# Altium schematic sheet [03] - 28PINS SCHEMATIC.SchDoc (part 1 of 3)
size A2; DocumentNumber: 3; SheetNumber: 3; SheetTotal: 5
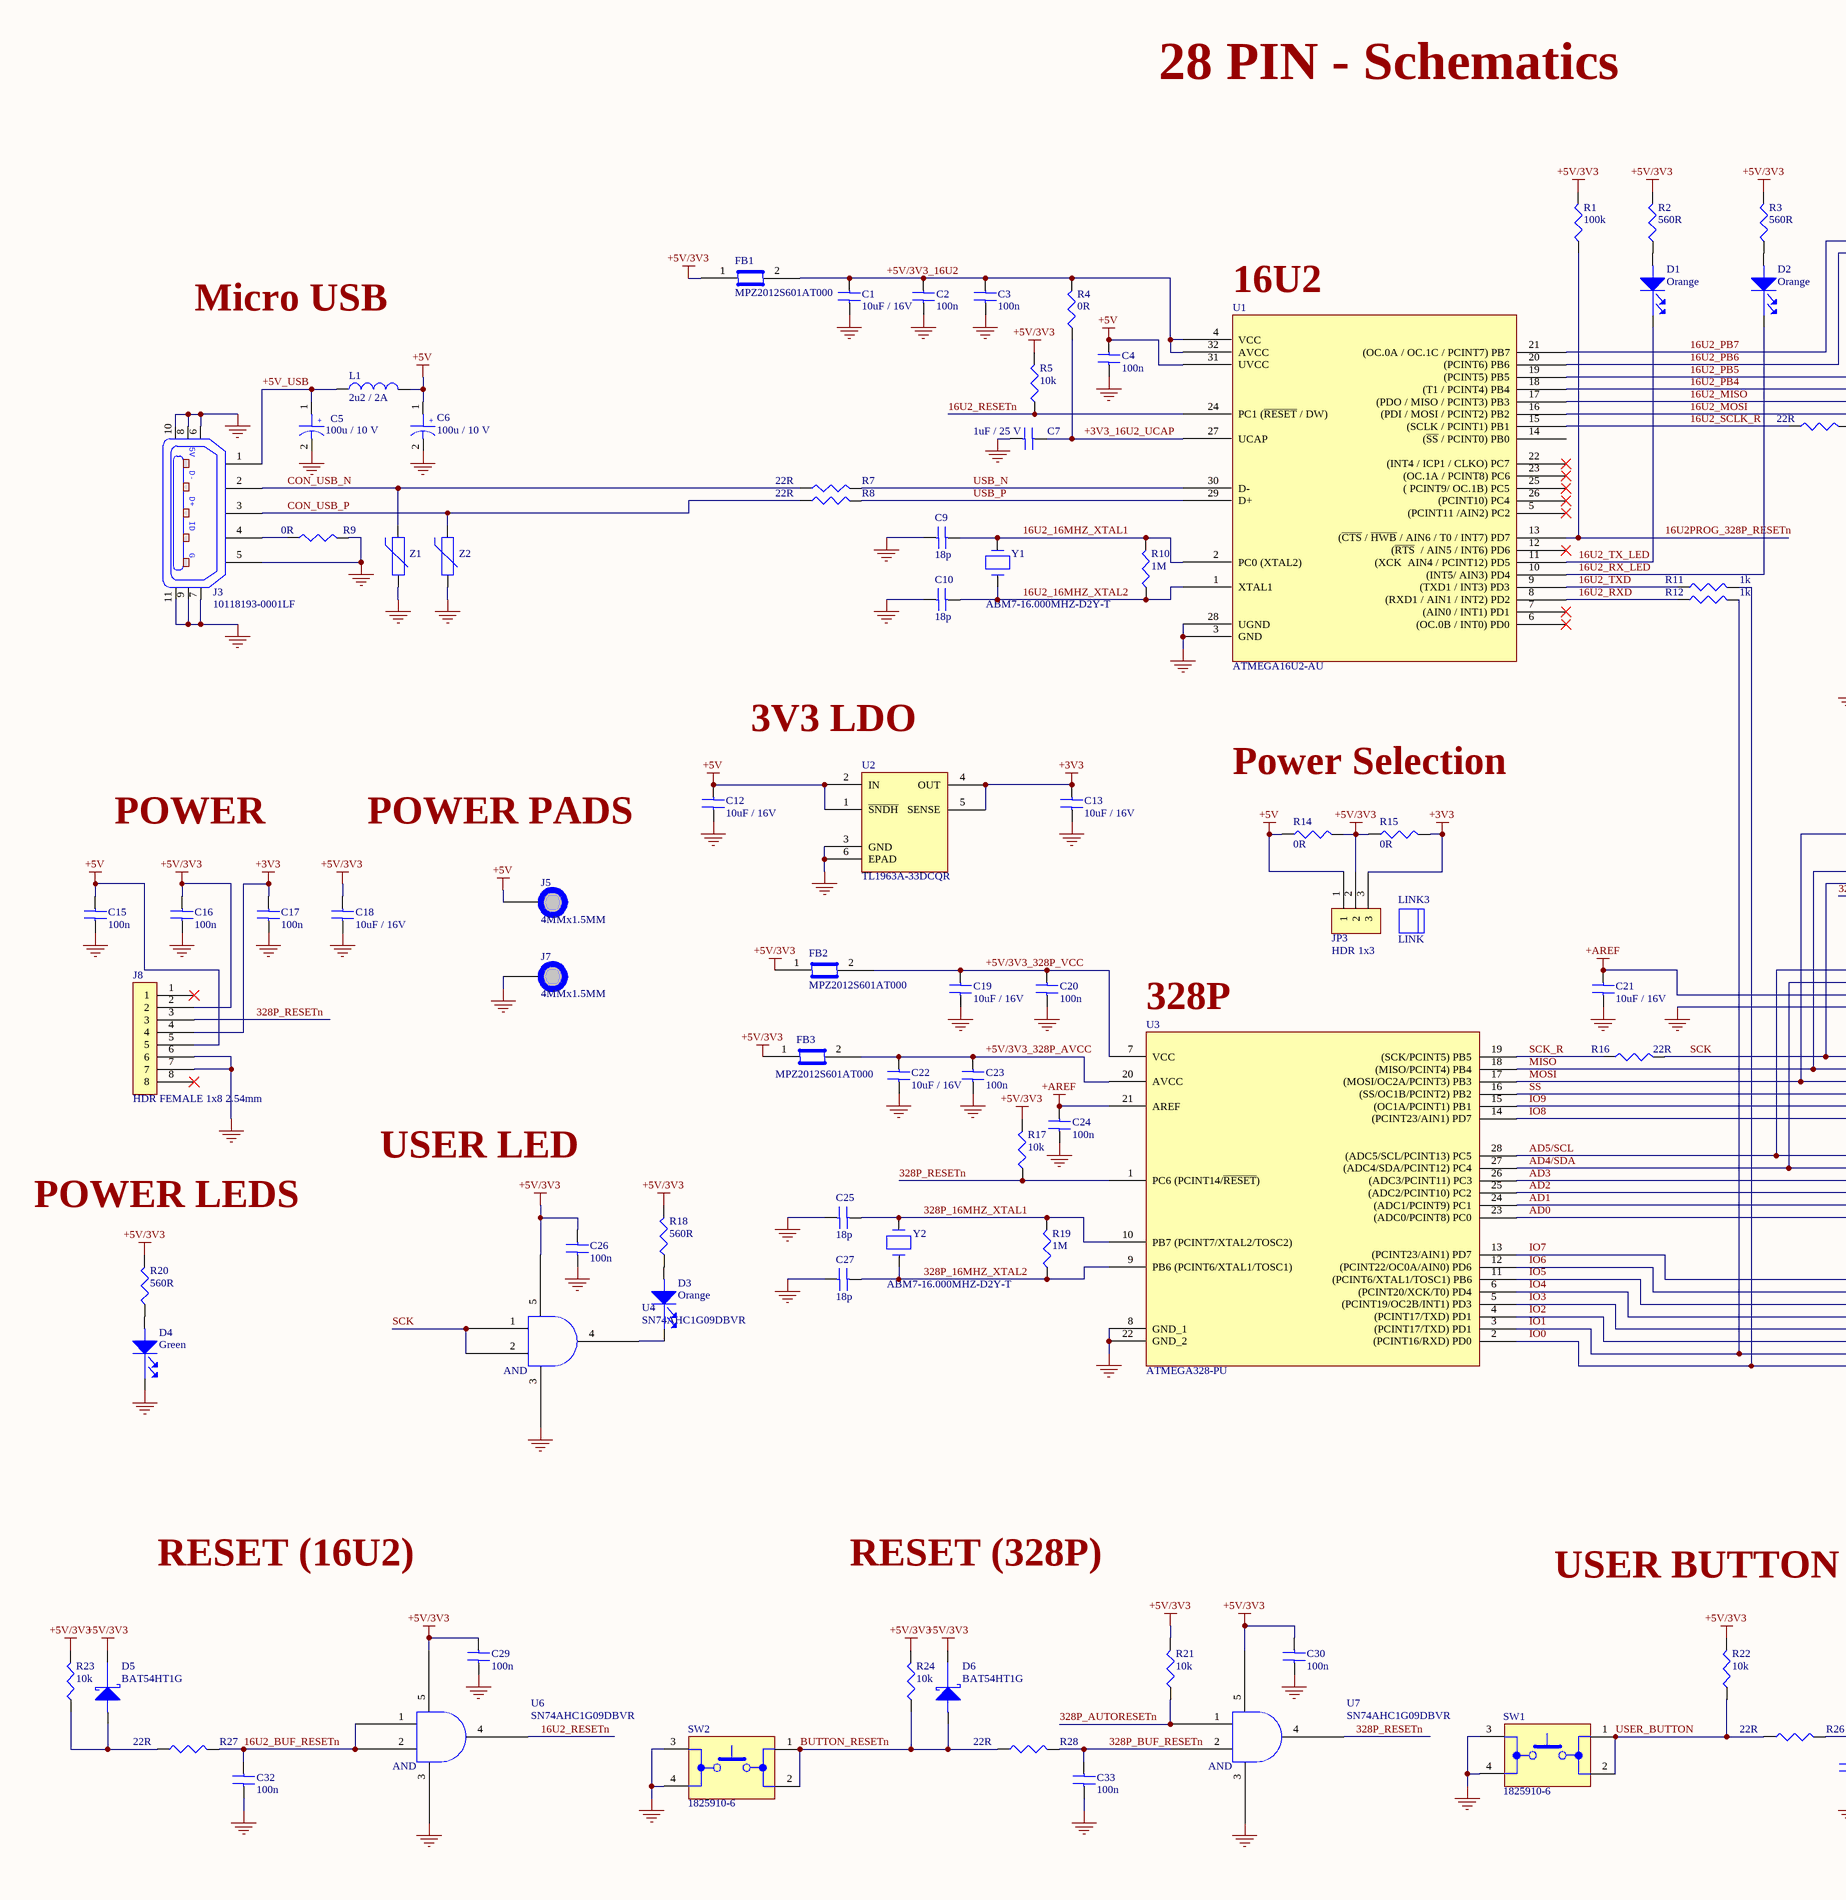
[diagram p0: [03] - 28PINS SCHEMATIC.SchDoc, left]
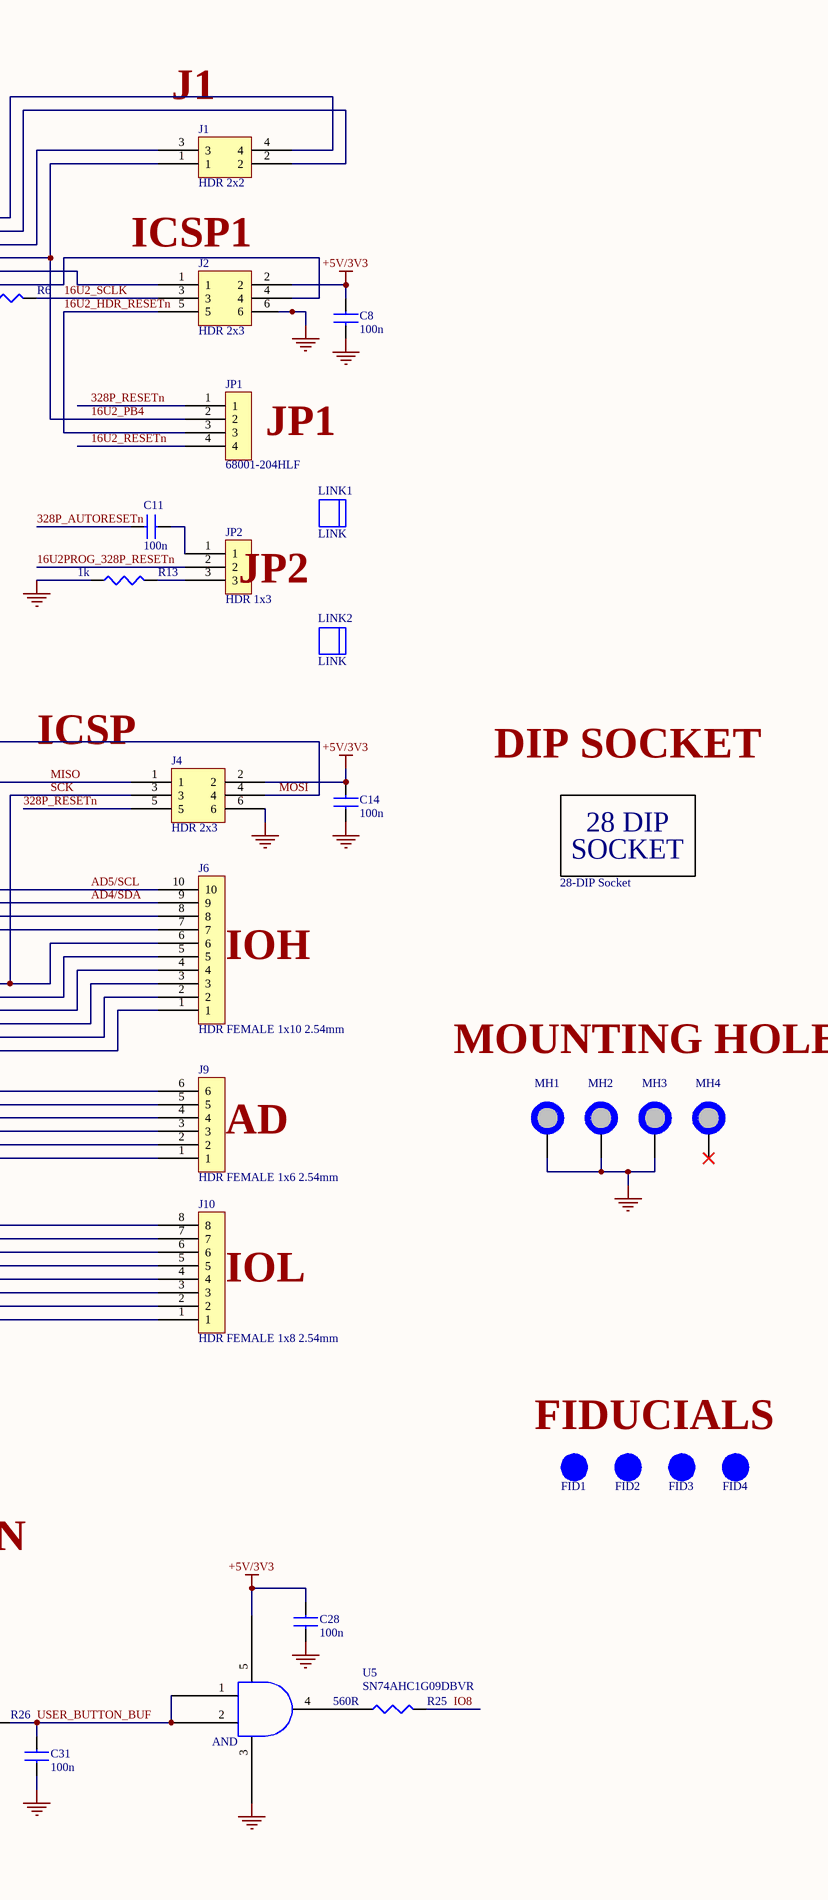
[diagram p1: [03] - 28PINS SCHEMATIC.SchDoc, right]

## Parts
C1  10uF / 16V  [C0805]
C2  100n  [C0805]
C3  100n  [C0805]
C4  100n  [C0805]
C5  100u / 10 V  [C_ALU_C_SIZE]
C6  100u / 10 V  [C_ALU_C_SIZE]
C7  1uF / 25 V  [C0805]
C8  100n  [C0805]
C9  18p  [C0805]
C10  18p  [C0805]
C11  100n  [C0805]
C12  10uF / 16V  [C0805]
C13  10uF / 16V  [C0805]
C14  100n  [C0805]
C15  100n  [C0805]
C16  100n  [C0805]
C17  100n  [C0805]
C18  10uF / 16V  [C0805]
C19  10uF / 16V  [C0805]
C20  100n  [C0805]
C21  10uF / 16V  [C0805]
C22  10uF / 16V  [C0805]
C23  100n  [C0805]
C24  100n  [C0805]
C25  18p  [C0805]
C26  100n  [C0805]
C27  18p  [C0805]
C28  100n  [C0805]
C29  100n  [C0805]
C30  100n  [C0805]
C31  100n  [C0805]
C32  100n  [C0805]
C33  100n  [C0805]
D1  Orange  [LED_0603]
D2  Orange  [LED_0603]
D3  Orange  [LED_0603]
D4  Green  [LED_0603]
D5  BAT54HT1G  [SOD323]
D6  BAT54HT1G  [SOD323]
FB1  MPZ2012S601AT000  [C0805]
FB2  MPZ2012S601AT000  [C0805]
FB3  MPZ2012S601AT000  [C0805]
FID1  FID_1MMC  [FID_40X120D]  (value not drawn)  (no BOM)
FID2  FID_1MMC  [FID_40X120D]  (value not drawn)  (no BOM)
FID3  FID_1MMC  [FID_40X120D]  (value not drawn)  (no BOM)
FID4  FID_1MMC  [FID_40X120D]  (value not drawn)  (no BOM)
J1  HDR 2x2  [HDR 2x2 2.54mm]
J2  HDR 2x3  [HDR 2x3 2.54mm]
J3  10118193-0001LF  [10118193]
J4  HDR 2x3  [HDR 2x3 2.54mm]
J5  4MMx1.5MM  [PAD_WITH_HOLE_4MMx1.5MM]  (no BOM)
J6  HDR FEMALE 1x10 2.54mm  [Hdr_Female_1x10_2.54mm]
J7  4MMx1.5MM  [PAD_WITH_HOLE_4MMx1.5MM]  (no BOM)
J8  HDR FEMALE 1x8 2.54mm  [Hdr_Female_1x8_2.54mm]
J9  HDR FEMALE 1x6 2.54mm  [Hdr_Female_1x6_2.54mm]
J10  HDR FEMALE 1x8 2.54mm  [Hdr_Female_1x8_2.54mm]
JP1  68001-204HLF  [Hdr_Female_1x4_2.54mm]
JP2  HDR 1x3  [Hdr_Female_1x3_2.54mm]
JP3  HDR 1x3  [Hdr_Female_1x3_2.54mm]
L1  2u2 / 2A  [C1210_IND]
LINK1  LINK  (mechanical)
LINK2  LINK  (mechanical)
LINK3  LINK  (mechanical)
MH1  MH_7.4MMC_3.2MMD  [MH_7.4MMD_3.2MMD]  (value not drawn)  (no BOM)
MH2  MH_7.4MMC_3.2MMD  [MH_7.4MMD_3.2MMD]  (value not drawn)  (no BOM)
MH3  MH_7.4MMC_3.2MMD  [MH_7.4MMD_3.2MMD]  (value not drawn)  (no BOM)
MH4  MH_7.4MMNC_3.2MMD  [MH_7.4MMD_3.2MMD_NON_COPPER_NPTH]  (value not drawn)  (no BOM)
R1  100k  [R0805]
R2  560R  [R0805]
R3  560R  [R0805]
R4  0R  [R0805]
R5  10k  [R0805]
R6  22R  [R0805]
R7  22R  [R0805]
R8  22R  [R0805]
R9  0R  [R0805]
R10  1M  [R0805]
R11  1k  [R0805]
R12  1k  [R0805]
R13  1k  [R0805]
R14  0R  [R0805]
R15  0R  [R0805]
R16  22R  [R0805]
R17  10k  [R0805]
R18  560R  [R0805]
R19  1M  [R0805]
R20  560R  [R0805]
R21  10k  [R0805]
R22  10k  [R0805]
R23  10k  [R0805]
R24  10k  [R0805]
R25  560R  [R0805]
R26  22R  [R0805]
R27  22R  [R0805]
R28  22R  [R0805]
SCKT_FOR_U1  28-DIP Socket  [28_DIP_7.62mm_SOCKET]
SW1  1825910-6  [1825910-6]
SW2  1825910-6  [1825910-6]
U1  ATMEGA16U2-AU  [TQFP32]
U2  TL1963A-33DCQR  [DCQ (R-PDSO-G6)]
U3  ATMEGA328-PU  [28_DIP_7.62mm]
U4  SN74AHC1G09DBVR  [DBV_SOT_23_5]
U5  SN74AHC1G09DBVR  [DBV_SOT_23_5]
U6  SN74AHC1G09DBVR  [DBV_SOT_23_5]
U7  SN74AHC1G09DBVR  [DBV_SOT_23_5]
Y1  ABM7-16.000MHZ-D2Y-T  [ABM7_v1_1_BIG]
Y2  ABM7-16.000MHZ-D2Y-T  [ABM7_v1_1_BIG]
Z1  CG0603MLC-05E  [R0603]  (value not drawn)
Z2  CG0603MLC-05E  [R0603]  (value not drawn)

## Nets
+3V3: C13.1 C17.2 J8.4 JP3.3 R15.2 U2.4(OUT) U2.5(SENSE)
+5V: C4.2 C6.1 C12.2 C15.2 J5.1 J8.5 JP3.1 L1.2 R14.1 U1.31(UVCC) U2.1(~{SNDH}) U2.2(IN)
+5V/3V3: C8.2 C14.2 C16.2 C18.2 C26.2 C28.2 C29.2 C30.2 D5.1(Cathode) D6.1(Cathode) FB1.1 FB2.1 FB3.1 J2.2 J4.2 J8.2 JP3.2 R1.2 R2.2 R3.2 R5.2 R14.2 R15.1 R17.2 R18.2 R20.2 R21.2 R22.2 R23.2 R24.2 U4.5 U5.5 U6.5 U7.5
+AREF: C21.2 C24.2 J6.8 U3.21(AREF)
GND: C1.2 C2.2 C3.2 C4.1 C5.2 C6.2 C7.1 C8.1 C9.1 C10.1 C12.1 C13.2 C14.1 C15.1 C16.1 C17.1 C18.1 C19.1 C20.1 C21.1 C22.1 C23.1 C24.1 C25.1 C26.1 C27.1 C28.1 C29.1 C30.1 C31.1 C32.1 C33.1 D4.1(Cathode) J2.6 J3.5 J3.6 J3.7 J3.8 J3.9 J3.10 J3.11 J4.6 J6.7 J7.1 J8.6 J8.7 MH1.1 MH2.1 MH3.1 R9.2 R13.1 SW1.3 SW1.4 SW2.3 SW2.4 U1.3(GND) U1.28(UGND) U2.3(GND) U2.6(EPAD) U3.8(GND_1) U3.22(GND_2) U4.3 U5.3 U6.3 U7.3 Z1.1 Z2.1
16U2_16MHZ_XTAL1: C9.2 R10.2 U1.2(PC0_(XTAL2)) Y1.2
16U2_16MHZ_XTAL2: C10.2 R10.1 U1.1(XTAL1) Y1.1
16U2_BUF_RESETn: C32.2 R27.2 U6.1 U6.2
16U2_HDR_RESETn: J2.5 JP1.3
16U2_MISO: J2.1 U1.17((PDO_/_MISO_/_PCINT3)_PB3)
16U2_MOSI: J2.4 U1.16((PDI_/_MOSI_/_PCINT2)_PB2)
16U2_PB4: J1.1 JP1.2 U1.18((T1_/_PCINT4)_PB4)
16U2_PB5: J1.3 U1.19((PCINT5)_PB5)
16U2_PB6: J1.2 U1.20((PCINT6)_PB6)
16U2_PB7: J1.4 U1.21((OC.0A_/_OC.1C_/_PCINT7)_PB7)
16U2_RESETn: JP1.4 R5.1 U1.24(PC1_(~{RESET}_/_DW)) U6.4
16U2_RX_LED: D2.1(Cathode) U1.10((INT5/_AIN3)_PD4)
16U2_RXD: R12.1 U1.8((RXD1_/_AIN1_/_INT2)_PD2)
16U2_SCLK: J2.3 R6.2
16U2_SCLK_R: R6.1 U1.15((SCLK_/_PCINT1)_PB1)
16U2_TX_LED: D1.1(Cathode) U1.11((XCK__AIN4_/_PCINT12)_PD5)
16U2_TXD: R11.1 U1.9((TXD1_/_INT3)_PD3)
16U2PROG_328P_RESETn: JP2.2 R1.1 U1.13((~{CTS}_/_~{HWB}_/_AIN6_/_T0_/_INT7)_PD7)
328P_16MHZ_XTAL1: C25.2 R19.2 U3.10(PB7_(PCINT7/XTAL2/TOSC2)) Y2.2
328P_16MHZ_XTAL2: C27.2 R19.1 U3.9(PB6_(PCINT6/XTAL1/TOSC1)) Y2.1
328P_AUTORESETn: C11.1 R21.1 U7.1
328P_BUF_RESETn: C33.2 R28.2 U7.2
328P_RESETn: J4.5 J8.3 JP1.1 R17.1 U3.1(PC6_(PCINT14/~{RESET})) U7.4
+3V3_16U2_UCAP: C7.2 R4.1 U1.27(UCAP)
+5V/3V3_16U2: C1.1 C2.1 C3.1 FB1.2 R4.2 U1.4(VCC) U1.32(AVCC)
+5V/3V3_328P_AVCC: C22.2 C23.2 FB3.2 U3.20(AVCC)
+5V/3V3_328P_VCC: C19.2 C20.2 FB2.2 U3.7(VCC)
+5V_USB: C5.1 J3.1 L1.1
AD0: J9.1 U3.23((ADC0/PCINT8)_PC0)
AD1: J9.2 U3.24((ADC1/PCINT9)_PC1)
AD2: J9.3 U3.25((ADC2/PCINT10)_PC2)
AD3: J9.4 U3.26((ADC3/PCINT11)_PC3)
AD4/SDA: J6.9 J9.5 U3.27((ADC4/SDA/PCINT12)_PC4)
AD5/SCL: J6.10 J9.6 U3.28((ADC5/SCL/PCINT13)_PC5)
BUTTON_RESETn: D6.2(Anode) R24.1 R28.1 SW2.1 SW2.2
CON_USB_N: J3.2 R7.1 Z1.2
CON_USB_P: J3.3 R8.1 Z2.2
IO0: J10.1 R11.2 U3.2((PCINT16/RXD)_PD0)
IO1: J10.2 R12.2 U3.3((PCINT17/TXD)_PD1)
IO2: J10.3 U3.4((PCINT17/TXD)_PD1)
IO3: J10.4 U3.5((PCINT19/OC2B/INT1)_PD3)
IO4: J10.5 U3.6((PCINT20/XCK/T0)_PD4)
IO5: J10.6 U3.11((PCINT6/XTAL1/TOSC1)_PB6)
IO6: J10.7 U3.12((PCINT22/OC0A/AIN0)_PD6)
IO7: J10.8 U3.13((PCINT23/AIN1)_PD7)
IO8: J6.1 R25.2 U3.14((PCINT23/AIN1)_PD7)
IO9: J6.2 U3.15((OC1A/PCINT1)_PB1)
MISO: J4.1 J6.5 U3.18((MISO/PCINT4)_PB4)
MOSI: J4.4 J6.4 U3.17((MOSI/OC2A/PCINT3)_PB3)
SCK: J4.3 J6.6 R16.2 U4.1 U4.2
SCK_R: R16.1 U3.19((SCK/PCINT5)_PB5)
SS: J6.3 U3.16((SS/OC1B/PCINT2)_PB2)
USB_N: R7.2 U1.30(D-)
USB_P: R8.2 U1.29(D+)
USER_BUTTON: R22.1 R26.1 SW1.1 SW1.2
USER_BUTTON_BUF: C31.2 R26.2 U5.1 U5.2
NetC11_2: C11.2 JP2.1
NetD1_2: D1.2(Anode) R2.1
NetD2_2: D2.2(Anode) R3.1
NetD3_1: D3.1(Cathode) U4.4
NetD3_2: D3.2(Anode) R18.1
NetD4_2: D4.2(Anode) R20.1
NetD5_2: D5.2(Anode) R23.1 R27.1
NetJ3_4: J3.4 R9.1
NetJP2_3: JP2.3 R13.2
NetR25_1: R25.1 U5.4

Not connected (* = marked no-connect by the designer): J8 1* 8*; MH4 1*; U1 5((PCINT11_/AIN2)_PC2)* 6((OC.0B_/_INT0)_PD0)* 7((AIN0_/_INT1)_PD1)* 12((~{RTS}__/_AIN5_/_INT6)_PD6)* 14((~{SS}_/_PCINT0)_PB0) 22((INT4_/_ICP1_/_CLKO)_PC7)* 23((OC.1A_/_PCINT8)_PC6)* 25((_PCINT9/_OC.1B)_PC5)* 26((PCINT10)_PC4)*

## Notes on the sheet
- 28 PIN - Schematics
- (near J1) J1
- Micro USB
- (near U1) 16U2
- (near J2) ICSP1
- JP1
- (near JP2) JP2
- 3V3 LDO
- Power Selection
- POWER
- POWER PADS
- ICSP
- DIP SOCKET
- (near U3) 328P
- (near J6) IOH
- MOUNTING HOLES
- USER LED
- POWER LEDS
- (near J9) AD
- (near J10) IOL
- FIDUCIALS
- RESET (16U2)
- RESET (328P)
- USER BUTTON
- (in symbol 4828-3004-CP) 28 DIP; SOCKET
- (in symbol 10118193-0001LF) 5V; D-; D+; ID; G
- (in symbol EEE-1AA101WR) +
- (in symbol SN74AHC1G09DBVR) AND